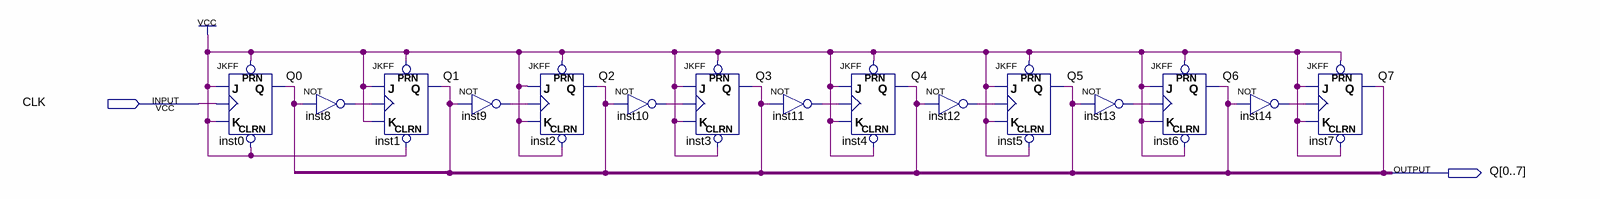
[diagram p0: schematic sheet]
// Quartus schematic ripplecounter.bdf as structural Verilog: 15 symbols, 2 pins
module ripplecounter (
  input  CLK,
  output [0:7] Q
);

  wire inst8_out, inst9_out, inst10_out, inst11_out, inst12_out, inst13_out, inst14_out;

  JKFF inst0 (.PRN(1'b1), .CLRN(1'b1), .K(1'b1), .J(1'b1), .CLK(CLK), .Q(Q[0]));
  not inst8 (inst8_out, Q[0]);
  JKFF inst1 (.PRN(1'b1), .CLRN(1'b1), .K(1'b1), .J(1'b1), .CLK(inst8_out), .Q(Q[1]));
  not inst9 (inst9_out, Q[1]);
  JKFF inst2 (.PRN(1'b1), .CLRN(1'b1), .K(1'b1), .J(1'b1), .CLK(inst9_out), .Q(Q[2]));
  not inst10 (inst10_out, Q[2]);
  JKFF inst3 (.PRN(1'b1), .CLRN(1'b1), .K(1'b1), .J(1'b1), .CLK(inst10_out), .Q(Q[3]));
  not inst11 (inst11_out, Q[3]);
  JKFF inst4 (.PRN(1'b1), .CLRN(1'b1), .K(1'b1), .J(1'b1), .CLK(inst11_out), .Q(Q[4]));
  not inst12 (inst12_out, Q[4]);
  JKFF inst5 (.PRN(1'b1), .CLRN(1'b1), .K(1'b1), .J(1'b1), .CLK(inst12_out), .Q(Q[5]));
  not inst13 (inst13_out, Q[5]);
  JKFF inst6 (.PRN(1'b1), .CLRN(1'b1), .K(1'b1), .J(1'b1), .CLK(inst13_out), .Q(Q[6]));
  not inst14 (inst14_out, Q[6]);
  JKFF inst7 (.PRN(1'b1), .CLRN(1'b1), .K(1'b1), .J(1'b1), .CLK(inst14_out), .Q(Q[7]));
endmodule
